# Altium schematic sheet Boost_5V.SchDoc
size Letter; SheetNumber: 11; SheetTotal: 12
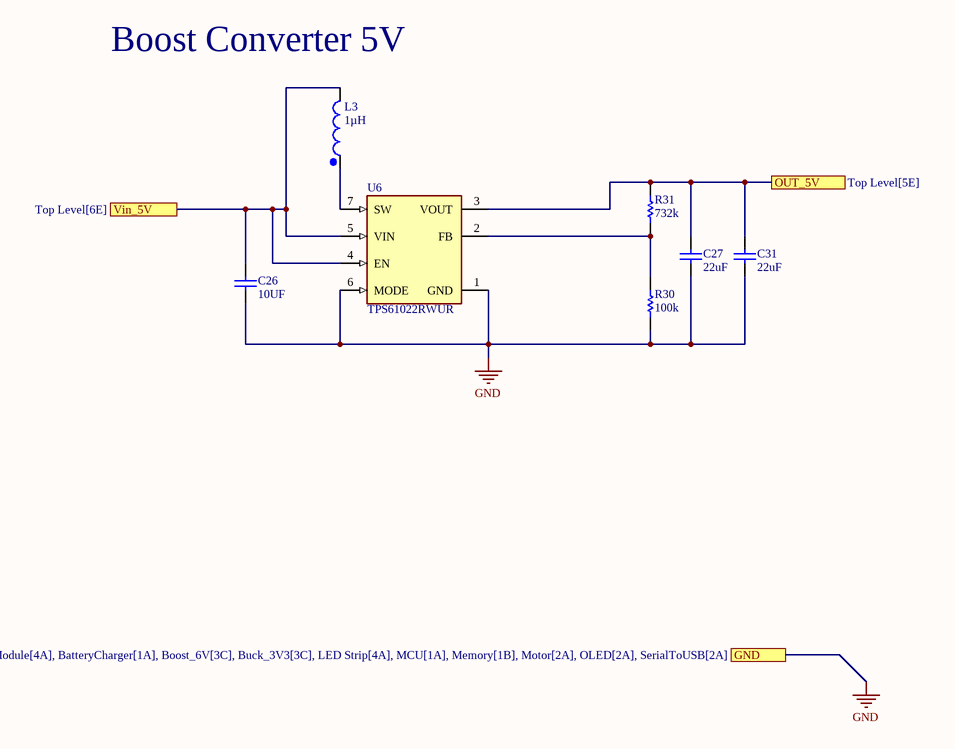
[diagram p0: Boost_5V.SchDoc]

## Parts
C26  value 10UF  [0603_CAP]  (hidden comment: CAP 0603 10UF 16V 20% X5R)
C27  value 22uF  [0805_CAP_60H]  (hidden comment: CAP 0805 22UF 10V 20% X5R)
C31  value 22uF  [0805_CAP_60H]  (hidden comment: CAP 0805 22UF 10V 20% X5R)
L3  value 1µH  [WE-HCI_7040]  (hidden comment: 744311100)
R30  value 100k  [0805_RES]  (hidden comment: RES 0805 100K 1%)
R31  value 732k  [0805_RES]  (hidden comment: RES 0805 732K 1%)
U6  TPS61022RWUR  [FP-RWU0007A-MFG]

## Ports
GND (see Top Level[6E], AI_Audio_Module[4A], BatteryCharger[1A], Boost_6V[3C], Buck_3V3[3C], LED Strip[4A], MCU[1A], Memory[1B], Motor[2A], OLED[2A], SerialToUSB[2A]), OUT_5V (see Top Level[5E]), Vin_5V (see Top Level[6E])

## Nets
GND: C26.1 C27.1 C31.1 R30.1 U6.1(GND) U6.6(MODE) ; port GND
OUT_5V: C27.2 C31.2 R31.2 U6.3(VOUT) ; port OUT_5V
Vin_5V: C26.2 L3.2 U6.4(EN) U6.5(VIN) ; port Vin_5V
NetL3_1: L3.1 U6.7(SW)
NetR30_2: R30.2 R31.1 U6.2(FB)

## Notes on the sheet
- (near L3) Boost Converter 5V
- Title:
- Desc:
- Size:
- Letter
- Auth:
- Proj:
- Sheet
- of
- www.seas.upenn.edu
- Electrical and Systems Engineering

## Library data of the parts
C26 = CMP-011-000263-1: Capacitor Surface Mount 0603 Footprint 10UF 16V 20% Tolerance Ceramic X5R; Manufacturer: Various; Description in Visual: Cap SMT 0603 10UF 16V 20% Ceramic X5R; PCB Package: 0603; Type: Ceramic X5R; Mount: SMT; Voltage: 16V; Tolerance: 20%; P/N: CAP 0603 10UF 16V 20% X5R; Manufacturer P/N: CAP 0603 10UF 16V 20% X5R
C27 C31 = CMP-011-000507-1: Capacitor Surface Mount 0805 Footprint 22UF 10V 20% Tolerance Ceramic X5R; Manufacturer: Various; PCB Package: 0805; Description in Visual: Cap SMT 0805 22UF 10V 20%  Cer X5R; Tolerance: 20%; P/N: CAP 0805 22UF 10V 20% X5R; Manufacturer P/N: CAP 0805 22UF 10V 20% X5R; Mount: SMT; Voltage: 10V; Type: Ceramic X5R
L3 = CMP-002-000018-2: General Purpose Inductor, 1uH, 20%, 1 Element, SMD, 2827; Package Height: 3.8mm; DC Resistance (DCR): 4.6mR; Shielding: Unshielded; Max Current Rating: 15A; Inductor Application: HIGH CURRENT INDUCTOR; Test Frequency: 100kHz; Case/Size Code: 2827; Shape/Size Description: RECTANGULAR PACKAGE; Package Length: 7mm; Self Resonant Frequency: 85MHz; Package Width: 6.9mm; Channels: 1; Inductor Type: GENERAL PURPOSE INDUCTOR; Terminal Placement: Dual Ended; Pins: 2; Termination: Wraparound; Tolerance: 20%; RoHS Compliant: Yes; Series: 744311100; Max Operating Temperature: 150°C; Construction: Magnetically Shielded; Min Operating Temperature: -40°C; Inductance-Nom (L): 1uH; Packaging: Tape and Reel; Terminal Finish: Copper; Reach SVHC Compliant: Yes; Package Style: SMTMeter; Surface Mount: Yes
R30 = CMP-005-004027-2: Resistor Surface Mount, 100K Ohms, 0805 Footprint, 1% Tolerance 0.125W; Manufacturer: Various; Description in Visual: Res SMT 100K 0805  1%  0.125W; PCB Package: 0805; Power Rating: 0.125W; Mount: SMT; Tolerance: 1%; Manufacturer P/N: RES 0805 100K 1%
R31 = CMP-005-005525-2: Resistor Surface Mount, 732K Ohms, 0805 Footprint, 1% Tolerance 0.125W; Manufacturer: Various; PCB Package: 0805; Description in Visual: Res SMT 732K 0805  1%  0.125W; Tolerance: 1%; Manufacturer P/N: RES 0805 732K 1%; Power Rating: 0.125W; Mount: SMT
U6 = CMP-04918-000029-1: POWER MANAGEMENT; Manufacturer: Texas Instruments; Switching Topology: Boost; Output Type: AdjustableProgrammable; Min Supply Voltage: 0.5V; Nominal Supply Current: 27uA; Standoff Height: 0mm; Max Junction Temp: +125°C; Output Current: 8A; Output Voltage: 2.2-5.5V; Max Supply Voltage: 5.5V; Switching Frequency: 600-1000kHz; Max Duty Cycle: 97%; Number Of Outputs: 1; Height: 1mm; Temperature Range High: +125°C; ComponentLink2Description: Datasheet; RoHS: TRUE; Octopart: https://octopart.com/tps61022rwur-texas+instruments-100045592; Digikey Description: POWER MANAGEMENT; Lead Free: Yes; Manufacturer Part Number: TPS61022RWUR; Device Class L3: Voltage Regulators - Switching; Automotive: No; Device Class L1: Integrated Circuits (ICs); Package: RWU0007A; Category: IC; Temperature Range Low: -40°C; Mouser Description: 8-A boost converter with 0.5-V ultra-low input voltage 7-VQFN-HR -40 to 125; ComponentLink2URL: http://www.ti.com/lit/ds/symlink/tps61022.pdf; Temperature: -40°C to +125°C; Device Class L2: Power Management ICs